# Altium schematic sheet RTC & IMU .SchDoc
size A; SheetNumber: 1; SheetTotal: 2
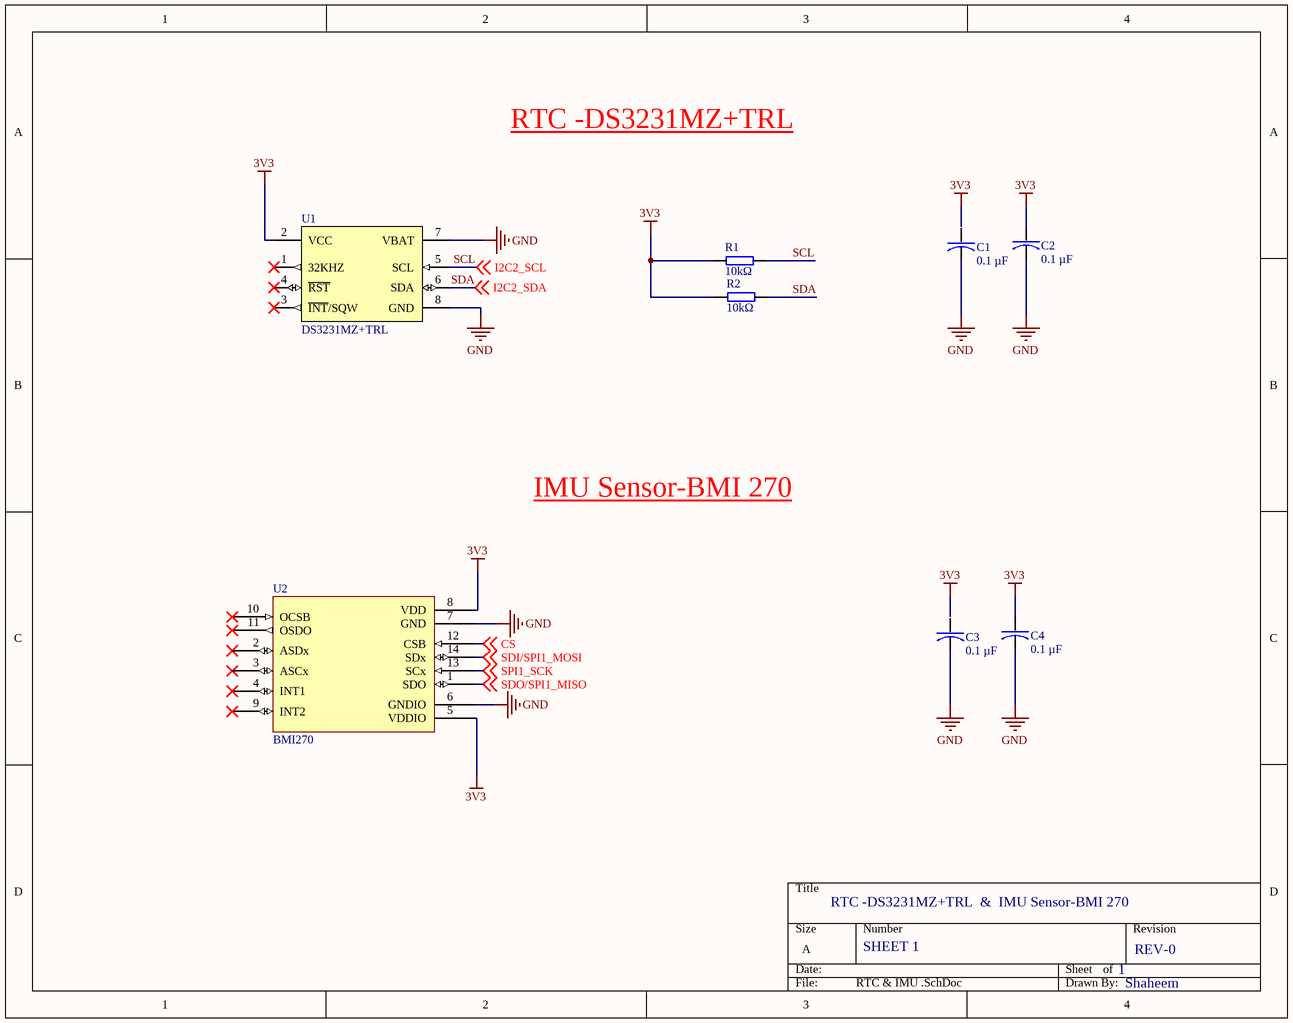
[diagram p0: RTC & IMU .SchDoc]

## Parts
C1  0.1 µF  [GRM155R71H104KE14-0.1uf ceramic capacitor]
C2  0.1 µF  [GRM155R71H104KE14-0.1uf ceramic capacitor]
C3  0.1 µF  [GRM155R71H104KE14-0.1uf ceramic capacitor]
C4  0.1 µF  [GRM155R71H104KE14-0.1uf ceramic capacitor]
R1  10kΩ  [RC0603FR-0710KL-10kohm Thick film.]
R2  10kΩ  [RC0603FR-0710KL-10kohm Thick film.]
U1  DS3231MZ+TRL  [DS3231MZ+TRL]
U2  BMI270  [BMI270]

## Nets
3V3: C2.2 C4.2 R1.2 R2.2 U1.2(VCC) U2.5(VDDIO) U2.8(VDD)
GND: C1.1 C2.1 C3.1 C4.1 U1.7(VBAT) U1.8(GND) U2.6(GNDIO) U2.7(GND)
CS: U2.12(CSB) ; off-sheet CS
SCL: R1.1 U1.5(SCL) ; off-sheet I2C2_SCL  [also labelled I2C2_SCL]
SDA: R2.1 U1.6(SDA) ; off-sheet I2C2_SDA  [also labelled I2C2_SDA]
SDI/SPI1_MOSI : U2.14(SDx) ; off-sheet SDI/SPI1_MOSI 
SDO/SPI1_MISO: U2.1(SDO) ; off-sheet SDO/SPI1_MISO
SPI1_SCK: U2.13(SCx) ; off-sheet SPI1_SCK

Not connected (* = marked no-connect by the designer): C1 2; C3 2; U1 1(32KHZ)* 3(~{INT}/SQW)* 4(~{RST})*; U2 2(ASDx)* 3(ASCx)* 4(INT1)* 9(INT2)* 10(OCSB)* 11(OSDO)*

## Notes on the sheet
- RTC -DS3231MZ+TRL
- IMU Sensor-BMI 270
- RTC -DS3231MZ+TRL  &  IMU Sensor-BMI 270
- SHEET 1
- 1
- REV-0
- Shaheem

## Library data of the parts
C1-C4 = GRM155R71E104KE14J- 0.1 µF: 0402 0.1 uF 25 V ±10% Tolerance X7R SMT Multilayer Ceramic Capacitor; Manufacturer: Murata; Manufacturer Lifecycle Status: IN PRODUCTION; Value: 100nF; Voltage Rating: 25V; Supplier: DigiKey; Supplier Part Number: 490-14603-2-ND; Manufacturer Part Number: GRM155R71E104KE14J; RoHS: Compliant; Category: Ceramic Capacitors; Stock: 1424920; Pricing: 50000=0.00435, 100000=0.00402, 150000=0.00386, 250000=0.00368, 350000=0.00357, 500000=0.00347 (USD); Case/Package: 0402; Case Code (Imperial): 0402; Case Code (Metric): 1005; Composition: Ceramic; Dielectric: X7R; Dielectric Material: Ceramic; Height: 500µm; Length: 1mm; Lifecycle Status: Production; Material: Ceramic; Max Operating Temperature: 125°C; Min Operating Temperature: -55°C; Mounting Technology: Surface Mount; Pins: 2; Number of Terminals: 2; Packaging: Tape & Reel (TR); REACH SVHC: Yes; Schedule B: 8532240020, 8532240020|8532240020, 8532240020|8532240020|8532240020, 8532240020|8532240020|8532240020|8532240020; Termination: SMD/SMT; Thickness: 500µm; Tolerance: 10%; Voltage Rating (DC): 25V; Weight: 6.010099mg; Width: 500µm; ComponentLink1URL: https://datasheet.octopart.com:443/GRM155R71E104KE14J-Murata-datasheet-155345056.pdf?src-supplier=Newark; ComponentLink1Description: https://datasheet.octopart.com:443/GRM155R71E104KE14J-Murata-datasheet-155345056.pdf?src-supplier=Newark; ComponentLink2URL: https://datasheet.octopart.com:443/GRM155R71E104KE14J-Murata-datasheet-165579666.pdf?src-supplier=TME; ComponentLink2Description: https://datasheet.octopart.com:443/GRM155R71E104KE14J-Murata-datasheet-165579666.pdf?src-supplier=TME; ComponentLink3URL: https://datasheet.octopart.com:443/GRM155R71E104KE14J-Murata-datasheet-141266224.pdf?src-supplier=Ciiva; ComponentLink3Description: https://datasheet.octopart.com:443/GRM155R71E104KE14J-Murata-datasheet-141266224.pdf?src-supplier=Ciiva; ComponentLink4URL: https://datasheet.octopart.com:443/GRM155R71E104KE14J-Murata-datasheet-140691366.pdf?src-supplier=Ciiva; ComponentLink4Description: https://datasheet.octopart.com:443/GRM155R71E104KE14J-Murata-datasheet-140691366.pdf?src-supplier=Ciiva; ComponentLink5URL: https://datasheet.octopart.com:443/GRM155R71E104KE14J-Murata-datasheet-138740936.pdf?src-supplier=Ciiva; ComponentLink5Description: https://datasheet.octopart.com:443/GRM155R71E104KE14J-Murata-datasheet-138740936.pdf?src-supplier=Ciiva; ComponentLink6URL: https://datasheet.octopart.com/GRM155R71E104KE14J-Murata-datasheet-12515295.pdf; ComponentLink6Description: https://datasheet.octopart.com/GRM155R71E104KE14J-Murata-datasheet-12515295.pdf; ComponentLink7URL: https://datasheet.octopart.com/GRM155R71E104KE14J-Murata-datasheet-12510076.pdf; ComponentLink7Description: https://datasheet.octopart.com/GRM155R71E104KE14J-Murata-datasheet-12510076.pdf; ComponentLink8URL: https://datasheet.octopart.com/GRM155R71E104KE14J-Murata-datasheet-11978611.pdf; ComponentLink8Description: https://datasheet.octopart.com/GRM155R71E104KE14J-Murata-datasheet-11978611.pdf; ComponentLink9URL: https://datasheet.octopart.com/GRM155R71E104KE14J-Murata-datasheet-10025737.pdf; ComponentLink9Description: https://datasheet.octopart.com/GRM155R71E104KE14J-Murata-datasheet-10025737.pdf; ComponentLink10URL: https://datasheet.octopart.com/GRM155R71E104KE14J-Murata-datasheet-8819587.pdf; ComponentLink10Description: https://datasheet.octopart.com/GRM155R71E104KE14J-Murata-datasheet-8819587.pdf; ComponentLink11URL: https://datasheet.octopart.com/GRM155R71E104KE14J-Murata-datasheet-15634843.pdf; ComponentLink11Description: https://datasheet.octopart.com/GRM155R71E104KE14J-Murata-datasheet-15634843.pdf; ComponentLink12URL: https://datasheet.octopart.com:443/GRM155R71E104KE14J-Murata-datasheet-144363483.pdf?src-supplier=Arrow.cn; ComponentLink12Description: https://datasheet.octopart.com:443/GRM155R71E104KE14J-Murata-datasheet-144363483.pdf?src-supplier=Arrow.cn; ComponentLink13URL: http://sigma.octopart.com:80/reach_statement/Murata-company-16.pdf?src-supplier=Compliance+Statements; ComponentLink13Description: http://sigma.octopart.com:80/reach_statement/Murata-company-16.pdf?src-supplier=Compliance+Statements; Supplier 1: DigiKey; Supplier Part Number 1: 490-14603-1-ND
R1 R2 = RC0603FR-0710KL-10kohm Thick film: 100mW Thick Film Resistors ±100ppm/℃ ±1% 10kΩ 0603 Chip Resistor - Surface Mount ROHS; Manufacturer: Yageo Group; Temperature Coefficient: 100ppm/°C; Voltage Rating: 75V; Voltage Rating (DC): 50V; Supplier: DigiKey; Supplier Part Number: 311-10.0KHRTR-ND; Manufacturer Part Number: RC0603FR-0710KL; RoHS: Compliant; Category: Chip SMD Resistors; Stock: 11777314; Pricing: 5000=0.00469, 10000=0.00414, 15000=0.00387, 25000=0.00358, 35000=0.00342, 50000=0.00326 (USD); Case/Package: 0603; Case Code (Imperial): 0603; Case Code (Metric): 0603; China RoHS: Non-Compliant; Composition: Thick Film; Contact Plating: Tin; Depth: 800µm; Height: 450µm; Lead Free: Lead Free; Lead Pitch: 300µm; Length: 1.6mm; Lifecycle Status: Production; Max Operating Temperature: 155°C; Military Standard: Not; Min Operating Temperature: -55°C; Mounting Technology: Surface Mount; Pins: 2; Number of Terminals: 2; Packaging: Tape & Reel; Power Rating: 100mW; Radiation Hardening: No; REACH SVHC: Yes; Value: 10kΩ; Schedule B: 8533210045, 8533210045|8533210045|8533210045|8533210045|8533210045|8533210045|8533210045|8533210045|8533210045|8533210045|8533210045|8533210045|8533210045|8533210045|8533210045|8533210045|8533210045|8533210045|8533210045|8533210045|8533210045|8533210045|8533210045|85; Termination: SMD/SMT; Tolerance: 1%; Weight: 2.012816mg; Width: 800µm; Working Voltage: 75V; ComponentLink1URL: https://datasheet.octopart.com:443/RC0603FR-0710KL-Yageo-datasheet-175887523.pdf?src-supplier=IHS; ComponentLink1Description: https://datasheet.octopart.com:443/RC0603FR-0710KL-Yageo-datasheet-175887523.pdf?src-supplier=IHS; ComponentLink2URL: https://datasheet.octopart.com:443/RC0603FR-0710KL-Yageo-datasheet-103092701.pdf?src-supplier=Upverter; ComponentLink2Description: https://datasheet.octopart.com:443/RC0603FR-0710KL-Yageo-datasheet-103092701.pdf?src-supplier=Upverter; ComponentLink3URL: https://datasheet.octopart.com:443/RC0603FR-0710KL-Yageo-datasheet-98239111.pdf?src-supplier=Upverter; ComponentLink3Description: https://datasheet.octopart.com:443/RC0603FR-0710KL-Yageo-datasheet-98239111.pdf?src-supplier=Upverter; ComponentLink4URL: https://datasheet.octopart.com:443/RC0603FR-0710KL-Yageo-datasheet-141265859.pdf?src-supplier=Upverter; ComponentLink4Description: https://datasheet.octopart.com:443/RC0603FR-0710KL-Yageo-datasheet-141265859.pdf?src-supplier=Upverter; ComponentLink5URL: https://sigma.octopart.com:443/138820526/technical_drawing/Yageo-RC0603FR-0710KL.pdf?src-supplier=Upverter; ComponentLink5Description: https://sigma.octopart.com:443/138820526/technical_drawing/Yageo-RC0603FR-0710KL.pdf?src-supplier=Upverter; ComponentLink6URL: https://datasheet.octopart.com:443/RC0603FR-0710KL-Yageo-datasheet-8328172.pdf?src-supplier=Farnell; ComponentLink6Description: https://datasheet.octopart.com:443/RC0603FR-0710KL-Yageo-datasheet-8328172.pdf?src-supplier=Farnell; ComponentLink7URL: https://datasheet.octopart.com:443/RC0603FR-0710KL-Yageo-datasheet-13691069.pdf?src-supplier=Farnell; ComponentLink7Description: https://datasheet.octopart.com:443/RC0603FR-0710KL-Yageo-datasheet-13691069.pdf?src-supplier=Farnell; ComponentLink8URL: https://datasheet.octopart.com:443/RC0603FR-0710KL-Yageo-datasheet-62067350.pdf?src-supplier=element14+APAC; ComponentLink8Description: https://datasheet.octopart.com:443/RC0603FR-0710KL-Yageo-datasheet-62067350.pdf?src-supplier=element14+APAC; ComponentLink9URL: https://datasheet.octopart.com:443/RC0603FR-0710KL-Yageo-datasheet-17842380.pdf?src-supplier=element14+APAC; ComponentLink9Description: https://datasheet.octopart.com:443/RC0603FR-0710KL-Yageo-datasheet-17842380.pdf?src-supplier=element14+APAC; ComponentLink10URL: https://datasheet.octopart.com:443/RC0603FR-0710KL-Yageo-datasheet-15599030.pdf?src-supplier=Future+Electronics; ComponentLink10Description: https://datasheet.octopart.com:443/RC0603FR-0710KL-Yageo-datasheet-15599030.pdf?src-supplier=Future+Electronics; ComponentLink11URL: https://datasheet.octopart.com:443/RC0603FR-0710KL-Yageo-Group-datasheet-176638170.pdf?src-supplier=Future+Electronics; ComponentLink11Description: https://datasheet.octopart.com:443/RC0603FR-0710KL-Yageo-Group-datasheet-176638170.pdf?src-supplier=Future+Electronics; ComponentLink12URL: https://datasheet.octopart.com:443/RC0603FR-0710KL-Yageo-datasheet-164759695.pdf?src-supplier=Future+Electronics; ComponentLink12Description: https://datasheet.octopart.com:443/RC0603FR-0710KL-Yageo-datasheet-164759695.pdf?src-supplier=Future+Electronics; ComponentLink13URL: https://datasheet.octopart.com:443/RC0603FR-0710KL-Yageo-datasheet-127823281.pdf?src-supplier=Future+Electronics; ComponentLink13Description: https://datasheet.octopart.com:443/RC0603FR-0710KL-Yageo-datasheet-127823281.pdf?src-supplier=Future+Electronics; ComponentLink14URL: https://datasheet.octopart.com:443/RC0603FR-0710KL-Yageo-datasheet-137700087.pdf?src-supplier=Future+Electronics; ComponentLink14Description: https://datasheet.octopart.com:443/RC0603FR-0710KL-Yageo-datasheet-137700087.pdf?src-supplier=Future+Electronics; ComponentLink15URL: https://datasheet.octopart.com:443/RC0603FR-0710KL-Yageo-datasheet-27584510.pdf?src-supplier=Future+Electronics; ComponentLink15Description: https://datasheet.octopart.com:443/RC0603FR-0710KL-Yageo-datasheet-27584510.pdf?src-supplier=Future+Electronics; ComponentLink16URL: https://datasheet.octopart.com:443/RC0603FR-0710KL-Yageo-datasheet-8324193.pdf?src-supplier=Future+Electronics; ComponentLink16Description: https://datasheet.octopart.com:443/RC0603FR-0710KL-Yageo-datasheet-8324193.pdf?src-supplier=Future+Electronics; ComponentLink17URL: https://datasheet.octopart.com:443/RC0603FR-0710KL-Yageo-datasheet-12596169.pdf?src-supplier=Newark; ComponentLink17Description: https://datasheet.octopart.com:443/RC0603FR-0710KL-Yageo-datasheet-12596169.pdf?src-supplier=Newark; ComponentLink18URL: https://datasheet.octopart.com:443/RC0603FR-0710KL-Yageo-datasheet-503470.pdf?src-supplier=Newark; ComponentLink18Description: https://datasheet.octopart.com:443/RC0603FR-0710KL-Yageo-datasheet-503470.pdf?src-supplier=Newark; ComponentLink19URL: https://datasheet.octopart.com:443/RC0603FR-0710KL-Yageo-datasheet-34211833.pdf?src-supplier=Newark; ComponentLink19Description: https://datasheet.octopart.com:443/RC0603FR-0710KL-Yageo-datasheet-34211833.pdf?src-supplier=Newark; ComponentLink20URL: https://datasheet.octopart.com:443/RC0603FR-0710KL-Yageo-Group-datasheet-189192902.pdf?src-supplier=LCSC; ComponentLink20Description: https://datasheet.octopart.com:443/RC0603FR-0710KL-Yageo-Group-datasheet-189192902.pdf?src-supplier=LCSC; ComponentLink21URL: https://datasheet.octopart.com:443/RC0603FR-0710KL-Yageo-datasheet-79472498.pdf?src-supplier=Megastar; ComponentLink21Description: https://datasheet.octopart.com:443/RC0603FR-0710KL-Yageo-datasheet-79472498.pdf?src-supplier=Megastar; ComponentLink22URL: https://datasheet.octopart.com/RC0603FR-0710KL-Yageo-datasheet-73766026.pdf; ComponentLink22Description: https://datasheet.octopart.com/RC0603FR-0710KL-Yageo-datasheet-73766026.pdf; ComponentLink23URL: https://datasheet.octopart.com:443/RC0603FR-0710KL-Yageo-datasheet-118562.pdf?src-supplier=DigiKey; ComponentLink23Description: https://datasheet.octopart.com:443/RC0603FR-0710KL-Yageo-datasheet-118562.pdf?src-supplier=DigiKey; ComponentLink24URL: http://sigma.octopart.com:80/conflict_mineral_statement/Yageo-company-3.pdf?src-supplier=Compliance+Statements; ComponentLink24Description: http://sigma.octopart.com:80/conflict_mineral_statement/Yageo-company-3.pdf?src-supplier=Compliance+Statements; ComponentLink25URL: http://sigma.octopart.com:80/rohs_statement/Yageo-company-2.pdf?src-supplier=Compliance+Statements; ComponentLink25Description: http://sigma.octopart.com:80/rohs_statement/Yageo-company-2.pdf?src-supplier=Compliance+Statements; Supplier 1: DigiKey; Supplier Part Number 1: 311-10.0KHRTR-ND
U1 = DS3231MZ+TRL: HH: MM: SS (12/24 hr) 128bit 2.3V 5.5V 2, I2C, Serial YY-MM-DD-dd SOIC-8 4.9mm*3.9mm*1.55mm; Manufacturer: Analog Devices; Manufacturer Lifecycle Status: PRODUCTION; Evaluation Kit: Yes; Logic Function: Clock; Operating Supply Voltage: 3.3V; Supplier: DigiKey; Supplier Part Number: 175-DS3231MZ+TRLCT-ND; Manufacturer Part Number: DS3231MZ+TRL; RoHS: Compliant; Category: Real Time Clocks; Stock: 7705; Pricing: 1=12.68, 10=9.957, 25=9.276, 100=8.5273, 250=8.30792 (USD); Case/Package: SOIC; Date Format: YY-MM-DD-dd; Interface: I2C; Lifecycle Status: Production; Max Operating Temperature: 85°C; Max Supply Voltage: 5.5V; Min Operating Temperature: -40°C; Min Supply Voltage: 2.3V; Mounting Technology: Surface Mount; Pins: 8; Packaging: Cut Tape; Radiation Hardening: No; REACH SVHC: Unknown; Schedule B: 8542390000|8542390000|8542390000|8542390000|8542390000|8542390000|8542390000|8542390000|8542390000|8542390000|8542390000|8542390000|8542390000|8542390000|8542390000|8542390000|8542390000|8542390000|8542390000|8542390000|8542390000|8542390000|8542390000|85; Time Format: HH:MM:SS (12/24 hr); ComponentLink1URL: https://octopart.com:443/opatz8j6/c1?t=VpmGs2zHwq00Ntx8-C9ikKrWpdgI_6obw9CoEXSkQfdREDwHx9U4_Gh7PrT9ZclzUn_6m4Pq1M-zYGe6wzlePTrl1SA5bCeYFsLi9k-K_BN8OYMW1V0JtQDIT4kcriXfwGGCwrRzvenitp_dqb225p-6G8oayRpm4GU0Y1emu0mIW65C5DaZ3BrlAfRfm8GYpCnrXLEmJEQyHcmUiA5Nzy8W1LVFDt8vFz8EnY90IgRDBtZDdZYAoJkwvFxciAvjGNj82WUZkEsiDwp3uyAXezmSTtNEHurlSpsIVX-KT_RE3oaxApzkU4du&src-supplier=Analog+Devices; ComponentLink1Description: https://octopart.com:443/opatz8j6/c1?t=VpmGs2zHwq00Ntx8-C9ikKrWpdgI_6obw9CoEXSkQfdREDwHx9U4_Gh7PrT9ZclzUn_6m4Pq1M-zYGe6wzlePTrl1SA5bCeYFsLi9k-K_BN8OYMW1V0JtQDIT4kcriXfwGGCwrRzvenitp_dqb225p-6G8oayRpm4GU0Y1emu0mIW65C5DaZ3BrlAfRfm8GYpCnrXLEmJEQyHcmUiA5Nzy8W1LVFDt8vFz8EnY90IgRDBtZDdZYAoJkwvFxciAvjGNj82WUZkEsiDwp3uyAXezmSTtNEHurlSpsIVX-KT_RE3oaxApzkU4du&src-supplier=Analog+Devices; ComponentLink2URL: https://datasheet.octopart.com:443/DS3231MZ%2BTRL-Dallas-Semiconductor-datasheet-13717986.pdf?src-supplier=Upverter; ComponentLink2Description: https://datasheet.octopart.com:443/DS3231MZ%2BTRL-Dallas-Semiconductor-datasheet-13717986.pdf?src-supplier=Upverter; ComponentLink3URL: https://datasheet.octopart.com:443/DS3231MZ%2BTRL-Analog-Devices-datasheet-62054857.pdf?src-supplier=LKR; ComponentLink3Description: https://datasheet.octopart.com:443/DS3231MZ%2BTRL-Analog-Devices-datasheet-62054857.pdf?src-supplier=LKR; ComponentLink4URL: https://datasheet.octopart.com:443/DS3231MZ%2BTRL-Maxim-Integrated-datasheet-159004021.pdf?src-supplier=Augswan; ComponentLink4Description: https://datasheet.octopart.com:443/DS3231MZ%2BTRL-Maxim-Integrated-datasheet-159004021.pdf?src-supplier=Augswan; ComponentLink5URL: https://sigma.octopart.com:443/138901689/technical_drawing/Maxim-Integrated-DS3231MZ%2BTRL.pdf?src-supplier=ShanghaiCT; ComponentLink5Description: https://sigma.octopart.com:443/138901689/technical_drawing/Maxim-Integrated-DS3231MZ%2BTRL.pdf?src-supplier=ShanghaiCT; ComponentLink6URL: https://datasheet.octopart.com:443/DS3231MZ%2BTRL-Analog-Devices-datasheet-166785826.pdf?src-supplier=Arrow.cn; ComponentLink6Description: https://datasheet.octopart.com:443/DS3231MZ%2BTRL-Analog-Devices-datasheet-166785826.pdf?src-supplier=Arrow.cn; ComponentLink7URL: http://sigma.octopart.com:80/conflict_mineral_statement/Analog-Devices-company-33.pdf?src-supplier=Compliance+Statements; ComponentLink7Description: http://sigma.octopart.com:80/conflict_mineral_statement/Analog-Devices-company-33.pdf?src-supplier=Compliance+Statements; ComponentLink8URL: http://sigma.octopart.com:80/reach_statement/Maxim-Integrated-company-67.pdf?src-supplier=Compliance+Statements; ComponentLink8Description: http://sigma.octopart.com:80/reach_statement/Maxim-Integrated-company-67.pdf?src-supplier=Compliance+Statements; ComponentLink9URL: http://sigma.octopart.com:80/rohs_statement/Maxim-Integrated-company-66.pdf?src-supplier=Compliance+Statements; ComponentLink9Description: http://sigma.octopart.com:80/rohs_statement/Maxim-Integrated-company-66.pdf?src-supplier=Compliance+Statements; ComponentLink10URL: http://sigma.octopart.com:80/conflict_mineral_statement/Maxim-Integrated-company-65.pdf?src-supplier=Compliance+Statements; ComponentLink10Description: http://sigma.octopart.com:80/conflict_mineral_statement/Maxim-Integrated-company-65.pdf?src-supplier=Compliance+Statements; ComponentLink11URL: https://octopart.com:443/opatz8j6/c1?t=O5yJd09fH_J-1-J7Sjpa8Psl9IfGxqzvmNEaE2vPwhX6krYTaPsKy1I9KkoB9rQXM3SgCLlmT5oBDBDTtZyhc1zDcDlc1aOxnE-J_wpiOqBfEYX8hFHqevKl8r9cHCoiIfwjzic-VURDx0gva05Lx4T5lPzB5IyMiPK7VCdNa558j-X2-LK2SStKHL9eLNqHayqDB_DqUtRK2yiq7i0mpCoEpnrWYypUsYqiEmKKvm8wmW-gOpJaGYgu_xqw4hITAyiYAztRLK6WjjeTTyeJa0m7jXSyuC6BBjwj42qGAEDvqlS3XScScTCX&src-supplier=Compliance+Statements; ComponentLink11Description: https://octopart.com:443/opatz8j6/c1?t=O5yJd09fH_J-1-J7Sjpa8Psl9IfGxqzvmNEaE2vPwhX6krYTaPsKy1I9KkoB9rQXM3SgCLlmT5oBDBDTtZyhc1zDcDlc1aOxnE-J_wpiOqBfEYX8hFHqevKl8r9cHCoiIfwjzic-VURDx0gva05Lx4T5lPzB5IyMiPK7VCdNa558j-X2-LK2SStKHL9eLNqHayqDB_DqUtRK2yiq7i0mpCoEpnrWYypUsYqiEmKKvm8wmW-gOpJaGYgu_xqw4hITAyiYAztRLK6WjjeTTyeJa0m7jXSyuC6BBjwj42qGAEDvqlS3XScScTCX&src-supplier=Compliance+Statements
U2 = BMI270: LGA-14(2.5x3) Attitude Sensor/Gyroscope ROHS; Manufacturer: Bosch Tools; Supplier: DigiKey; Supplier Part Number: 828-1091-6-ND; Manufacturer Part Number: BMI270; RoHS: Compliant; Category: Sensors; Stock: 7097; Pricing: 1=4.23, 5=3.788, 10=3.624, 25=3.428, 50=3.2942, 100=3.1715, 500=2.92464, 1000=2.8327 (USD); Export Control Classification Number (ECCN) Code: EAR99; Introduction Date: 2019-05-31; Lifecycle Status: Production; REACH SVHC: Yes; ComponentLink1URL: https://datasheet.octopart.com:443/BMI270-Bosch-Tools-datasheet-181206537.pdf?src-supplier=IHS; ComponentLink1Description: https://datasheet.octopart.com:443/BMI270-Bosch-Tools-datasheet-181206537.pdf?src-supplier=IHS; ComponentLink2URL: https://datasheet.octopart.com:443/BMI270-Bosch-Tools-datasheet-136061757.pdf?src-supplier=Future+Electronics; ComponentLink2Description: https://datasheet.octopart.com:443/BMI270-Bosch-Tools-datasheet-136061757.pdf?src-supplier=Future+Electronics